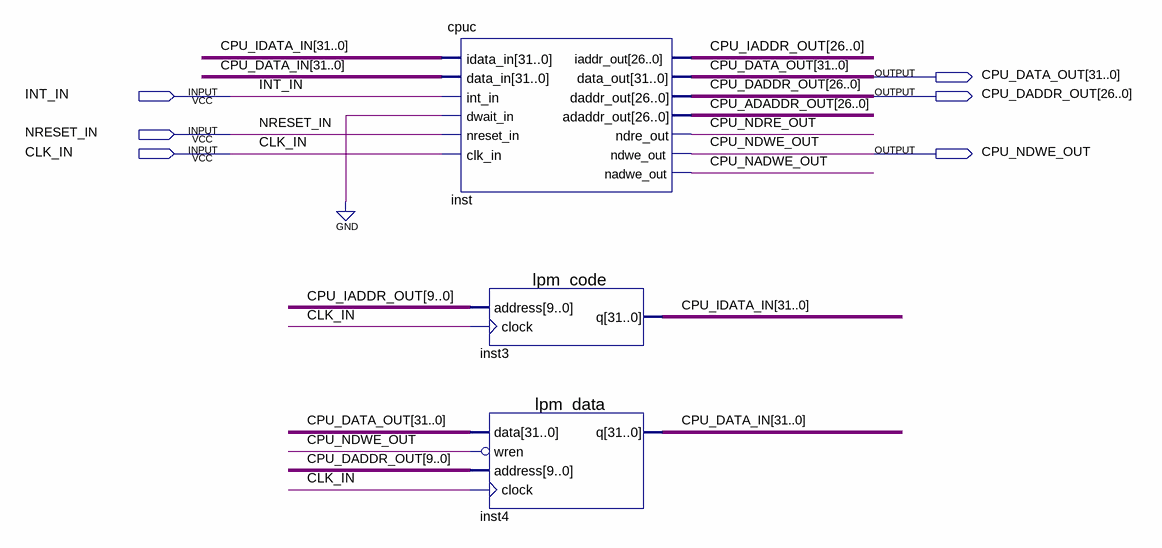
[diagram p0: schematic sheet]
// Quartus schematic cpu32bit.bdf as structural Verilog: 3 symbols, 6 pins
module cpu32bit (
  input  INT_IN,
  input  NRESET_IN,
  input  CLK_IN,
  output [31:0] CPU_DATA_OUT,
  output [26:0] CPU_DADDR_OUT,
  output CPU_NDWE_OUT
);

  wire CPU_NADWE_OUT, CPU_NDRE_OUT;
  wire [26:0] CPU_ADADDR_OUT, CPU_IADDR_OUT;
  wire [31:0] CPU_DATA_IN, CPU_IDATA_IN;

  cpuc inst (
    .idata_in(CPU_IDATA_IN), .data_in(CPU_DATA_IN), .int_in(INT_IN), .dwait_in(1'b0), .nreset_in(NRESET_IN),
    .clk_in(CLK_IN), .iaddr_out(CPU_IADDR_OUT), .data_out(CPU_DATA_OUT), .daddr_out(CPU_DADDR_OUT),
    .adaddr_out(CPU_ADADDR_OUT), .ndre_out(CPU_NDRE_OUT), .ndwe_out(CPU_NDWE_OUT), .nadwe_out(CPU_NADWE_OUT));
  lpm_code inst3 (.address(CPU_IADDR_OUT[9:0]), .clock(CLK_IN), .q(CPU_IDATA_IN));
  lpm_data inst4 (
    .data(CPU_DATA_OUT), .wren(~CPU_NDWE_OUT), .address(CPU_DADDR_OUT[9:0]), .clock(CLK_IN), .q(CPU_DATA_IN));
endmodule
